# EAGLE schematic daughter (EAGLE 6.6.0)
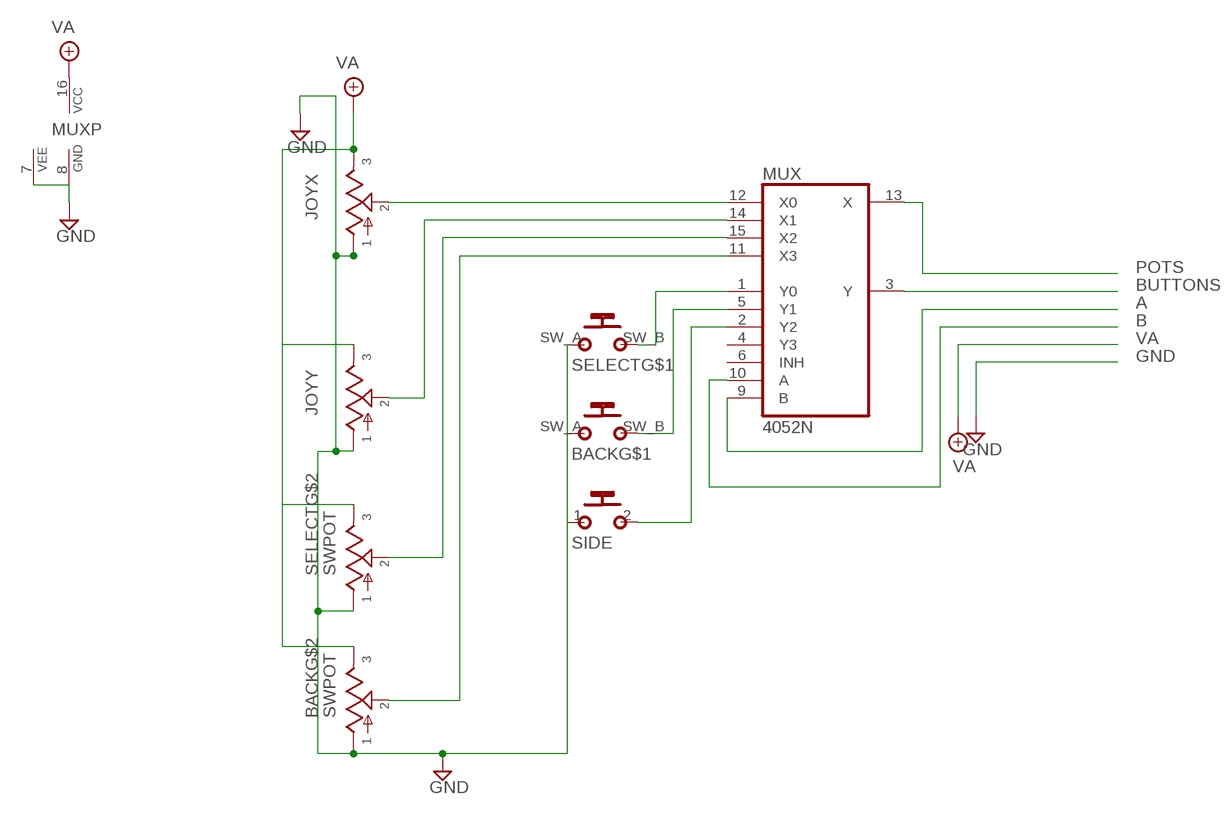
[diagram p0: schematic, sheet 1]

## Parts
BACK  SWPOT  [SWPOT]
JOYX  POT  [POT]
JOYY  POT  [POT]
MUX  4052N  [DIL16]
SELECT  SWPOT  [SWPOT]
SIDE  MOMENTARY  [SPST]

## Nets
A: MUX.9(B)
B: MUX.10(A)
BBACK: BACK.SW_B(B_B) MUX.5(Y1)
BSEL: MUX.1(Y0) SELECT.SW_B(B_B)
BSIDE: MUX.2(Y2) SIDE.2(S)
BUTTONS: MUX.3(Y)
GND: BACK.POT_B BACK.SW_A(B_A) JOYX.1 JOYY.1 MUX.7(VEE) MUX.8(GND) SELECT.POT_B SELECT.SW_A(B_A) SIDE.1(P)
POTBACK: BACK.POT_W MUX.11(X3)
POTS: MUX.13(X)
POTSEL: MUX.15(X2) SELECT.POT_W
VA: BACK.POT_A JOYX.3 JOYY.3 MUX.16(VCC) SELECT.POT_A
X: JOYX.2 MUX.12(X0)
Y: JOYY.2 MUX.14(X1)
Unconnected: MUX.4(Y3) MUX.6(INH)

## Library data of the parts
BACK SELECT = jaapie:SWPOT
JOYX JOYY = gm-pots:POT: Potentiometers the arrow indicates the clockwise motion of th wiper (lug 2) fully counter clockwise there is no resistance between lugs 1 and 2 fully clockwise the resistance between lugs 1 and 2 is the value of the pot
MUX = 40xx:4052: Dual 4-channel ANALOG MULTIPLEXER
SIDE = gm-switches:MOMENTARY